# Altium schematic sheet top.SchDoc
size A
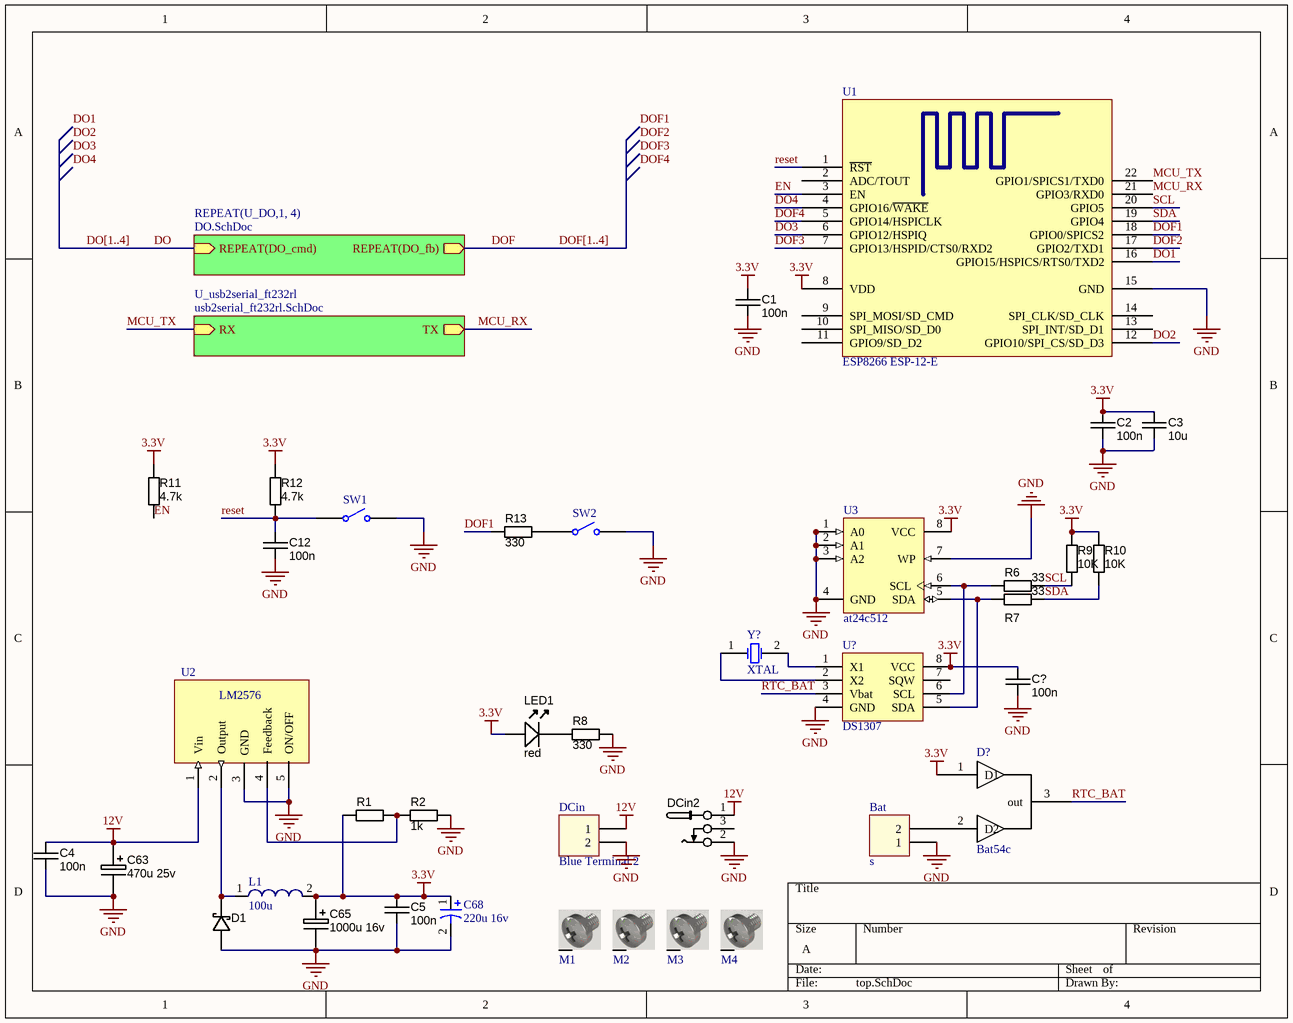
[diagram p0: top.SchDoc]

## Parts
Bat  s  [bat-stand]
C1  100n  [CAPC1608X90N]
C2  100n  [CAPC1608X90N]
C3  10u  [CAPC2012X135N]
C4  100n  [CAPC1608X90N]
C5  100n  [CAPC1608X90N]
C12  100n  [CAPC1608X90N]
C63  470u 25v  [CAP_ELEC_SIZE_G]
C65  1000u 16v  [CAP_ELEC_SIZE_G]
C68  220u 16v  [WCAP-PSLP_6.3x7.7]
C?  100n  [CAPC1608X90N]
D1  ss34  [DO-214AA]  (value not drawn)
D?  Bat54c  [SOT23-3]
DCin  Blue Terminal 2  [691253510002]
DCin2  CONN_PWR_JACK_2.1x5.5mm  [CONN_PWR_JACK_2.1x5.5mm]  (value not drawn)
L1  100u  [WE-PD 1210]
LED1  Color: red  [LED-0805-K]
M1  Screw  [Board Screw_No Silk]  (value not drawn)
M2  Screw  [Board Screw_No Silk]  (value not drawn)
M3  Screw  [Board Screw_No Silk]  (value not drawn)
M4  Screw  [Board Screw_No Silk]  (value not drawn)
R1  1.7  [RESC1608X55N]  (value not drawn)
R2  1k  [RESC1608X55N]
R6  33  [RESC1608X55N]
R7  33  [RESC1608X55N]
R8  330  [RESC1608X55N]
R9  10K  [RESC1608X55N]
R10  10K  [RESC1608X55N]
R11  4.7k  [RESC1608X55N]
R12  4.7k  [RESC1608X55N]
R13  330  [RESC1608X55N]
SW1  (no value)  [434111043826]
SW2  (no value)  [434111043826]
U1  ESP8266 ESP-12-E  [ESP8266 ESP-12-E]
U2  LM2576  [LM2576 SMd]  (value not drawn)
U3  at24c512  [SOIC127P600X175-8AN]
U?  DS1307  [SOIC127P600X175-8AN]
Y?  XTAL  [R38]

## Sub-sheets
REPEAT(U_DO,1, 4) = DO.SchDoc: REPEAT(DO_cmd) (in), REPEAT(DO_fb) (out)
U_usb2serial_ft232rl = usb2serial_ft232rl.SchDoc: RX (in), TX (out)

## Nets
3.3V: C1.2 C2.2 C3.1 C5.2 C65.1 C68.1 C?.2 D?.1(D1) L1.2 LED1.A R1.1 R9.2 R10.2 R11.1 R12.1 U1.8(VDD) U3.8(VCC) U?.8(VCC)
12V: C4.2 C63.1 DCin.1 DCin2.1 U2.1(Vin)
GND: Bat.1 C1.1 C2.1 C3.2 C4.1 C5.1 C12.1 C63.2 C65.2 C68.2 C?.1 D1.A DCin.2 DCin2.2 R2.2 R8.1 SW1.2 SW2.2 U1.15(GND) U2.3(GND) U2.5(ON/OFF) U3.1(A0) U3.2(A1) U3.3(A2) U3.4(GND) U3.7(WP) U?.4(GND)
DO: sheet REPEAT(U_DO,1, 4)/REPEAT(DO_cmd)
DO1: U1.16(GPIO15/HSPICS/RTS0/TXD2)
DO2: U1.12(GPIO10/SPI_CS/SD_D3)
DO3: U1.6(GPIO12/HSPIQ)
DO4: U1.4(GPIO16/~{WAKE})
DOF: sheet REPEAT(U_DO,1, 4)/REPEAT(DO_fb)
DOF1: R13.2 U1.18(GPIO0/SPICS2)
DOF2: U1.17(GPIO2/TXD1)
DOF3: U1.7(GPIO13/HSPID/CTS0/RXD2)
DOF4: U1.5(GPIO14/HSPICLK)
EN: R11.2 U1.3(EN)
MCU_RX: U1.21(GPIO3/RXD0) ; sheet U_usb2serial_ft232rl/TX
MCU_TX: U1.22(GPIO1/SPICS1/TXD0) ; sheet U_usb2serial_ft232rl/RX
reset: C12.2 R12.2 SW1.1 U1.1(~{RST})
RTC_BAT: D?.3(out) U?.3(Vbat)
SCL: R6.2 R9.1 U1.20(GPIO5)
SDA: R7.2 R10.1 U1.19(GPIO4)
NetBat_2: Bat.2 D?.2(D2)
NetD1_K: D1.K L1.1 U2.2(Output)
NetLED1_K: LED1.K R8.2
NetR1_2: R1.2 R2.1 U2.4(Feedback)
NetR6_1: R6.1 U3.6(SCL) U?.6(SCL)
NetR7_1: R7.1 U3.5(SDA) U?.5(SDA)
NetR13_1: R13.1 SW2.1
NetU?_1: U?.1(X1) Y?.2(OSC2)
NetU?_2: U?.2(X2) Y?.1(OSC1)

Not connected (* = marked no-connect by the designer): DCin2 3; M1 S; M2 S; M3 S; M4 S; U1 2(ADC/TOUT) 9(SPI_MOSI/SD_CMD) 10(SPI_MISO/SD_D0) 11(GPIO9/SD_D2) 13(SPI_INT/SD_D1) 14(SPI_CLK/SD_CLK); U? 7(SQW)

## Buses and harness runs
bus DO[1..4]
bus DOF[1..4]

## Notes on the sheet
- Labels drawn without touching a wire or pin: DO1, DO2, DO3, DO4, DOF1, DOF2, DOF3, DOF4

## Library data of the parts
Bat DCin = 691253510002: Terminal 2pin stand; Pitch: 5.08 mm; Pin Number: 2; ComponentLink1Description: Manufacturer; ComponentLink1URL: http://www.we-online.de; ComponentLink2Description: Datasheet; ComponentLink2URL: http://katalog.we-online.de/em/datasheet/6912535100xx.pdf; Part Number: 691253510002; Published Date: March 2017; Publisher: Wurth Elektronik
C1 C2 C4 C5 C12 C? = CAPC_1n_0603_X7R_100V_10%: Capacitor 0603; Manufacturer 1: Murata Electronics North America; Manufacturer Part Number 1: GCM188R72A102KA37D; Tolerance: ±10%; Ratings: 100V; X7R; Material: ceramic; SCDType: spec; Package / Case: 0603 (1608 metric); Supplier 1: Digi-Key; Supplier Part Number 1: 490-4780-1-ND; Operating Temperature: -55°C ~ 125°C; Size / Dimension: 0.063" L x 0.031" W (1.60mm x 0.80mm); Thickness (Max): 0.035" (0.90mm); ComponentLink1URL: http://search.murata.co.jp/Ceramy/image/img/PDF/ENG/GCM188R72A102KA37.pdf; ComponentLink1Description: http://search.murata.co.jp/Ceramy/image/img/PDF/ENG/GCM188R72A102KA37.pdf; Value: 100n
C3 = CAPC_4u7_0805: Capacitor 0805; Manufacturer 1: Taiyo Yuden; Manufacturer Part Number 1: EMK212BJ475KG-T; Tolerance: ±10%; Ratings: 16V; X5R; Material: ceramic; SCDType: spec; Package / Case: 0805 (2012 Metric); Supplier 1: Digi-Key; Supplier Part Number 1: 587-1294-1-ND; Operating Temperature: -55°C ~ 85°C; Size / Dimension: 0.079" L x 0.049" W (2.00mm x 1.25mm); Thickness (Max): 0.053" (1.35mm); ComponentLink1URL: http://www.yuden.co.jp/productdata/catalog/en/mlcc01_e.pdf; ComponentLink1Description: http://www.yuden.co.jp/productdata/catalog/en/mlcc01_e.pdf; Supplier 2: Digi-Key; Supplier Part Number 2: 1276-1065-1-ND; Manufacturer 2: Samsung Electro-Mechanics America, Inc; Manufacturer Part Number 2: CL21A475KOFNNNE; RoHS 2: RoHS Compliant; ComponentLink2URL: http://www.samsungsem.com/servlet/FileDownload?type=spec&file=CL21A475KOFNNNE.pdf; ComponentLink2Description: http://www.samsungsem.com/servlet/FileDownload?type=spec&file=CL21A475KOFNNNE.pdf; Supplier 3: Digi-Key; Supplier Part Number 3: 399-8101-1-ND; Manufacturer 3: Kemet; Manufacturer Part Number 3: C0805C475K4PACTU; RoHS 3: RoHS Compliant; ComponentLink3URL: http://capacitoredge.kemet.com/capedge2/DataSheet?pn=C0805C475K4PACTU; ComponentLink3Description: http://capacitoredge.kemet.com/capedge2/DataSheet?pn=C0805C475K4PACTU; Supplier 4: Digi-Key; Supplier Part Number 4: 490-7215-1-ND; Manufacturer 4: Murata Electronics North America; Manufacturer Part Number 4: GRM21BR61C475MA88L; RoHS 4: RoHS Compliant; ComponentLink4URL: http://psearch.murata.com/capacitor/product/GRM21BR61C475MA88#.pdf; ComponentLink4Description: http://psearch.murata.com/capacitor/product/GRM21BR61C475MA88#.pdf; Supplier 5: Digi-Key; Supplier Part Number 5: 445-7640-1-ND; Manufacturer 5: TDK Corporation; Manufacturer Part Number 5: C2012X5R1C475K125AC; RoHS 5: RoHS Compliant; ComponentLink5URL: http://product.tdk.com/capacitor/mlcc/en/documents/mlcc_commercial_general_en.pdf; ComponentLink5Description: http://product.tdk.com/capacitor/mlcc/en/documents/mlcc_commercial_general_en.pdf; RoHS 1: RoHS Compliant; Value: 10u
C63 C65 = CAPE_220u_10V_SMD: Capacitor SMD Alum Elec 220uF 20% 10V; Manufacturer 1: Panasonic - ECG; Manufacturer Part Number 1: EEE-FK1A221P; Ratings: 10V; 105°C; Material: Al; SCDType: undef; Package / Case: Radial - Surface Mount; Tolerance: ±20%; Supplier 1: Digi-Key; Supplier Part Number 1: PCE3775CT-ND
  C63: Value: 470u 25v
  C65: Value: 1000u 16v
C68 = WCAP-PSLP 6.3x7.7x2.2 875105445007: Capacitor smd Alum; Manufacturer: Wurth Elektronik; E-mail: libraries@we-online.com; Capacitance: 56 μF; Characteristics: Aluminum Polymer Capacitors;Recommended soldering: Reflow;Operating temperature: –55 °C to +105 °C;Low profile SMD product series;Low ESR at high frequency range;High permissible ripple current;Load life: 2000 h @ +105 °C; ComponentLink1Description: Manufacturer; ComponentLink1URL: http://www.we-online.com; ComponentLink2Description: Datasheet; ComponentLink2URL: http://katalog.we-online.de/pbs/datasheet/875105445007.pdf; Created by: Karrer Zheng; Created Date: 5/13/2015; Application: Low voltage port filtering, appplid to high-end switching power supply, PC(desktop,laptop ),industrial computer, VGA card, server power, charger, TV, digital set-top box,DC-DC power module, game machine etc which consume large current with high speed circuit.; partNo: 875105445007
D1 = DIODE_SCHOTTKY_MBRS130L: ss34 DO-214AA; Manufacturer 1: Fairchild Semiconductor; Material: Si; Ratings: 30Vr; 2A; SCDType: source; Package / Case: DO-214AA, SMB; Supplier 1: Digi-Key; Supplier Part Number 1: MBRS130LFSCT-ND; Manufacturer Part Number 1: MBRS130L
DCin2 = CONN_PWR_JACK_2.1x5.5mm: Power Connector, THT, 2.1mm ID, 5.5mm OD; Manufacturer 1: CUI Inc; Manufacturer Part Number 1: PJ-102AH; SCDType: undef; Category: Connectors; Mounting Type: Through Hole; Package / Case: PCB mount; Value: 2.1mm ID, 5.5mm OD
L1 = WE-PD 1210, XXL, 7447709680: inductor; Manufacturer: Würth Elektronik eiSos GmbH; Inductance: 68.0 µH; partNo: 7447709680; ComponentLink1Description: Manufacturer; ComponentLink1URL: http://www.we-online.de; Created by: Christin Zierenner; Created Date: June 2009; ComponentLink2Description: Datasheet; ComponentLink2URL: http://www.we-online.de/katalog/media/pdf/7447709680.pdf
LED1 = LED_SMD_Red_0805_6mcd: LED 0805 red; Manufacturer 1: Lite-On Inc; Manufacturer Part Number 1: LTST-C171EKT; Material: GaAsP on GaP; Ratings: 6 mcd; 621 nm; SCDType: source; Package / Case: 0805; Supplier 1: Digi-Key; Supplier Part Number 1: 160-1422-1-ND; Value: red
M1-M4 = Board Screw: Board Screw With Spacer
R1 R2 R6 R7 R9 R10 = RES_2K2_0603_5%: Resistor 0603; Manufacturer 1: Yageo; Manufacturer Part Number 1: RC0603JR-072K2L; Ratings: 1/10 W; Tolerance: ±5%; SCDType: spec; Temperature Coefficient: ±100ppm/°C; Package / Case: 0603 (1608 metric); Material: Thick Film; Supplier 1: Digi-Key; Supplier Part Number 1: 311-2.2KGRDKR-ND; RoHS 1: RoHS Compliant; ComponentLink1URL: http://www.yageo.com/documents/recent/PYu-RC0603_51_RoHS_L_4.pdf; ComponentLink1Description: http://www.yageo.com/documents/recent/PYu-RC0603_51_RoHS_L_4.pdf; Supplier 2: Digi-Key; Supplier Part Number 2: 1276-5070-6-ND; Manufacturer 2: Samsung Electro-Mechanics America, Inc; Manufacturer Part Number 2: RC1608J222CS; RoHS 2: RoHS Compliant; ComponentLink2URL: http://www.samsungsem.com/servlet/FileDownload?filename=productcatalog/pdf/Chip_Resistor.pdf; ComponentLink2Description: http://www.samsungsem.com/servlet/FileDownload?filename=productcatalog/pdf/Chip_Resistor.pdf; Supplier 3: Digi-Key; Supplier Part Number 3: RMCF0603JT2K20DKR-ND; Manufacturer 3: Stackpole Electronics Inc; Manufacturer Part Number 3: RMCF0603JT2K20; RoHS 3: RoHS Compliant; ComponentLink3URL: http://www.seielect.com/Catalog/SEI-RMCF_RMCP.pdf; ComponentLink3Description: http://www.seielect.com/Catalog/SEI-RMCF_RMCP.pdf; Supplier 4: Digi-Key; Supplier Part Number 4: RHM2.2KCGDKR-ND; Manufacturer 4: Rohm Semiconductor; Manufacturer Part Number 4: MCR03ERTJ222; RoHS 4: RoHS Compliant; ComponentLink4URL: http://rohmfs.rohm.com/en/products/databook/datasheet/passive/resistor/chip_resistor/mcr_g.pdf; ComponentLink4Description: http://rohmfs.rohm.com/en/products/databook/datasheet/passive/resistor/chip_resistor/mcr_g.pdf; Supplier 5: Digi-Key; Supplier Part Number 5: P2.2KGDKR-ND; Manufacturer 5: Panasonic Electronic Components; Manufacturer Part Number 5: ERJ-3GEYJ222V; RoHS 5: RoHS Compliant; ComponentLink5URL: http://industrial.panasonic.com/www-cgi/jvcr13pz.cgi?E+PZ+3+AOA0001+ERJ3GEYJ222V+7+WW; ComponentLink5Description: http://industrial.panasonic.com/www-cgi/jvcr13pz.cgi?E+PZ+3+AOA0001+ERJ3GEYJ222V+7+WW
  R2: Value: 1k
  R6 R7: Value: 33
  R9 R10: Value: 10K
R8 R13 = RES_820R_0603_1%: Resistor 0603; Manufacturer Part Number 1: RC0603FR-07820RL; Manufacturer 1: Yageo; Ratings: 1/10W; SCDType: undef; Tolerance: ±1%; Package / Case: 0603 (1608 Metric); Supplier 1: Digi-Key; Supplier Part Number 1: 311-820HRCT-ND; Value: 330
R11 R12 = RES_1K5_0603_5%: Resistor 0603; Manufacturer 1: Yageo; Manufacturer Part Number 1: RC0603JR-071K5L; Ratings: 1/10 W; Tolerance: ±5%; SCDType: spec; Package / Case: 0603 (1608 metric); Material: thick film; Supplier 1: Digi-Key; Supplier Part Number 1: 311-1.5KGRCT-ND; Value: 4.7k
SW1 SW2 = WE-Tact Switches WS-TASV 434111043826: SMD Tact Switch 6.0X3.5 mm; Manufacturer: W¨¹rth Elektronik eiSos GmbH & Co.KG; ComponentLink1 Description: Manufacturer; ComponentLink2 Description: Datasheet; Creat by: Karrer Zheng; NoPins: 02; Creat Date: 5 March February 2014; partNo: 434111043826; ComponentLink1URL: http://www.we-online.com; ComponentLink2URL: http://katalog.we-online.de/em/datasheet/434111043826.pdf
U3 = AT24C01BN-SP25-B: DatasheetVersion: 8517C,  Jan-2009; PackageVersion: revC, Mar-2005; PackageReference: 8S1; PackageDescription: 8-Lead (0.150" Wide Body), Plastic Gull Wing Small Outline (JEDEC SOIC); Code_JEDEC: MS-012-AA; Code_IPC: SOIC127P600-8; ComponentLink1Description: Manufacturer URL; ComponentLink1URL: http://www.atmel.com/; ComponentLink2Description: Datasheet; ComponentLink2URL: http://www.atmel.com/dyn/resources/prod_documents/doc8517.pdf
Y? = XTAL: Crystal Oscillator; Published: 8-Jun-2000; LatestRevisionDate: 17-Jul-2002; LatestRevisionNote: Re-released for DXP Platform.; PackageReference: R38; Publisher: Altium Limited; PackageDescription: Crystal, Thru-Hole; 2 Leads; Body 3.1 x 8.2 mm (Dia.xH)